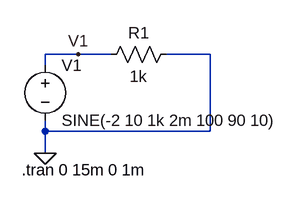
[diagram p0: schematic E1-Fuente-sinusoidal.asc]
E1-Fuente-sinusoidal.asc, the LTspice schematic file:
Version 4
SHEET 1 880 680
WIRE -864 144 -912 144
WIRE -816 144 -864 144
WIRE -672 144 -736 144
WIRE -912 160 -912 144
WIRE -912 256 -912 240
WIRE -672 256 -672 144
WIRE -672 256 -912 256
WIRE -912 288 -912 256
FLAG -912 288 0
FLAG -864 144 V1
SYMBOL voltage -912 144 R0
WINDOW 123 0 0 Left 0
WINDOW 39 0 0 Left 0
SYMATTR InstName V1
SYMATTR Value SINE(-2 10 1k 2m 100 90 10)
SYMBOL res -720 128 R90
WINDOW 0 0 56 VBottom 2
WINDOW 3 32 56 VTop 2
SYMATTR InstName R1
SYMATTR Value 1k
SYMATTR SpiceLine pwr=1
TEXT -946 312 Left 2 !.tran 0 15m 0 1m

The netlist it stands for:
* E1-Fuente-sinusoidal.asc
V1 V1 0 SINE(-2 10 1k 2m 100 90 10)
R1 0 V1 1k pwr=1
.tran 0 15m 0 1m
.backanno
.end